# EAGLE design Quectel-2560-v2.2 (EAGLE 8.5.1)
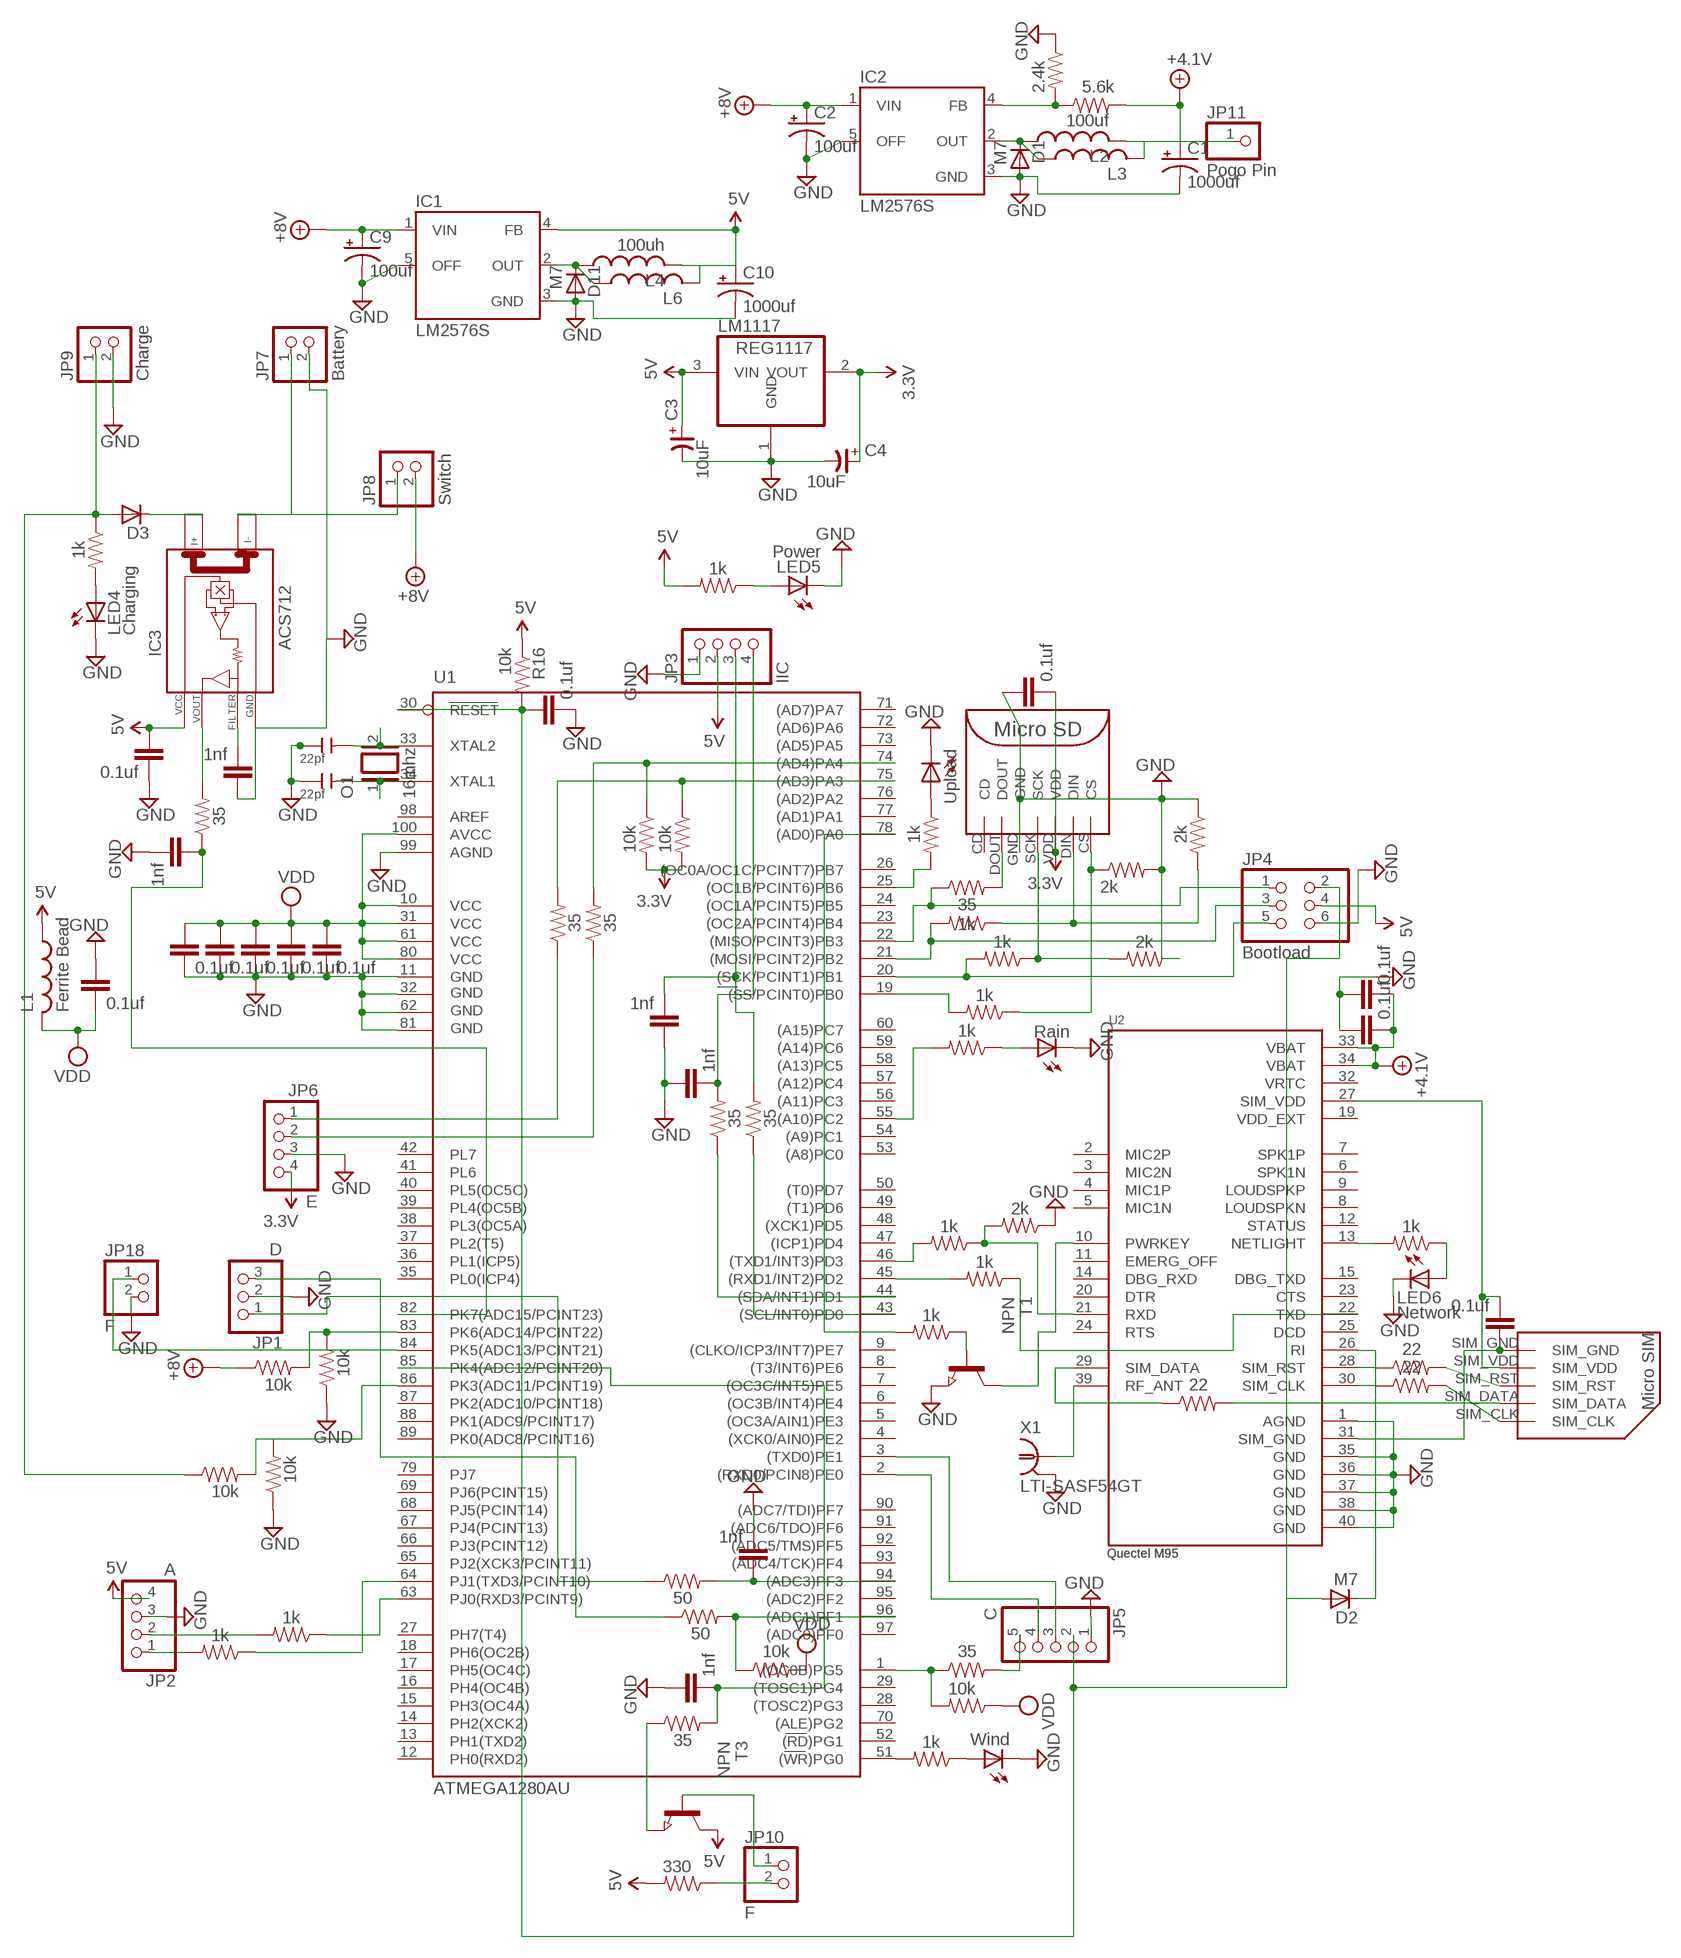
[diagram p0: schematic, sheet 1]

## Parts
C1  1000uf  CPOL-US153CLV-1012  [153CLV-1012]
C2  100uf  CPOL-USCT7343  [CT7343]
C3  10uF  CP-3528  [3528/T]
C4  10uF  CP-3528  [3528/T]
C7  22pf  CERAMIC-22PF-50V-5%-NPO(0805)  [C0805]
C8  22pf  CERAMIC-22PF-50V-5%-NPO(0805)  [C0805]
C9  100uf  CPOL-USCT7343  [CT7343]
C10  1000uf  CPOL-US153CLV-1012  [153CLV-1012]
D1  M7  BYS10  [SOD106A]
D2  M7  BYS10  [SOD106A]
D3  BYS10  [SOD106A]
D11  M7  BYS10  [SOD106A]
DC1  0.1uf  C-EUC0805  [C0805]
DC2  0.1uf  C-EUC0805  [C0805]
DC3  0.1uf  C-EUC0805  [C0805]
DC4  0.1uf  C-EUC0805  [C0805]
DC5  0.1uf  C-EUC0805  [C0805]
DC6  0.1uf  C-EUC0805  [C0805]
DC7  0.1uf  C-EUC0805  [C0805]
DC10  0.1uf  C-EUC0805  [C0805]
DC11  0.1uf  C-EUC0805  [C0805]
DC12  1nf  C-EUC0805  [C0805]
DC13  1nf  C-EUC0805  [C0805]
DC14  1nf  C-EUC0805  [C0805]
DC15  0.1uf  C-EUC0805  [C0805]
DC17  1nf  C-EUC0805  [C0805]
DC18  0.1uf  C-EUC0805  [C0805]
DC19  0.1uf  C-EUC0805  [C0805]
DC20  1nf  C-EUC0805  [C0805]
DC21  1nf  C-EUC0805  [C0805]
IC1  LM2576S  [TO263-5]
IC2  LM2576S  [TO263-5]
IC3  ACS712  [SO08]
JP1  D  PINHD-1X3  [1X03]
JP2  A  PINHD-1X4  [1X04]
JP3  IIC  PINHD-1X4  [1X04]
JP4  Bootload  PINHD-2X3  [2X03]
JP5  C  PINHD-1X5  [1X05]
JP6  E  PINHD-1X4  [1X04]
JP7  Battery  PINHD-1X2  [1X02]
JP8  Switch  PINHD-1X2  [1X02]
JP9  Charge  PINHD-1X2  [1X02]
JP10  F  PINHD-1X2  [1X02]
JP11  Pogo Pin  PINHD-1X1  [1X01]
JP18  F  PINHD-1X2  [1X02]
L1  Ferrite Bead  L-USL2012C  [L2012C]
L2  100uf  L-USPIS2816  [PIS2816]
L3  L-US6000-XXX-RC  [6000-XXXX-RC]
L4  100uh  L-USPIS2816  [PIS2816]
L6  L-US6000-XXX-RC  [6000-XXXX-RC]
LED1  Rain  LEDCHIP-LED0805  [CHIP-LED0805]
LED2  Upload  LEDCHIP-LED0805  [CHIP-LED0805]
LED3  Wind  LEDCHIP-LED0805  [CHIP-LED0805]
LED4  Charging  LEDCHIP-LED0805  [CHIP-LED0805]
LED5  Power  LEDCHIP-LED0805  [CHIP-LED0805]
LED6  Network  LEDCHIP-LED0805  [CHIP-LED0805]
LM1117  REG1117  [SOT223]
O1  16mhz  XTAL/S  [QS]
R1  35  RESISTOR0805-RES  [0805]
R2  10k  RESISTOR0805-RES  [0805]
R3  10k  RESISTOR0805-RES  [0805]
R4  1k  RESISTOR0805-RES  [0805]
R5  35  RESISTOR0805-RES  [0805]
R6  1k  RESISTOR0805-RES  [0805]
R7  1k  RESISTOR0805-RES  [0805]
R8  1k  RESISTOR0805-RES  [0805]
R9  2k  RESISTOR0805-RES  [0805]
R10  22  RESISTOR0805-RES  [0805]
R11  22  RESISTOR0805-RES  [0805]
R14  1k  RESISTOR0805-RES  [0805]
R15  1k  RESISTOR0805-RES  [0805]
R16  10k  RESISTOR0805-RES  [0805]
R17  1k  RESISTOR0805-RES  [0805]
R18  1k  RESISTOR0805-RES  [0805]
R19  35  RESISTOR0805-RES  [0805]
R20  10k  RESISTOR0805-RES  [0805]
R21  50  RESISTOR0805-RES  [0805]
R22  35  RESISTOR0805-RES  [0805]
R23  2k  RESISTOR0805-RES  [0805]
R24  2k  RESISTOR0805-RES  [0805]
R25  1k  RESISTOR0805-RES  [0805]
R26  1k  RESISTOR0805-RES  [0805]
R27  1k  RESISTOR0805-RES  [0805]
R28  1k  RESISTOR0805-RES  [0805]
R29  2k  RESISTOR0805-RES  [0805]
R30  35  RESISTOR0805-RES  [0805]
R31  50  RESISTOR0805-RES  [0805]
R32  1k  RESISTOR0805-RES  [0805]
R33  1k  RESISTOR0805-RES  [0805]
R34  10k  RESISTOR0805-RES  [0805]
R35  35  RESISTOR0805-RES  [0805]
R36  10k  RESISTOR0805-RES  [0805]
R39  35  RESISTOR0805-RES  [0805]
R40  10k  RESISTOR0805-RES  [0805]
R41  330  RESISTOR0805-RES  [0805]
R42  35  RESISTOR0805-RES  [0805]
R43  10k  RESISTOR0805-RES  [0805]
R44  10k  RESISTOR0805-RES  [0805]
R45  2.4k  RESISTOR0805-RES  [0805]
R46  5.6k  RESISTOR0805-RES  [0805]
R47  22  RESISTOR0805-RES  [0805]
T1  NPN  NPN-TRANSISTOR_SOT23  [SOT23]
T3  NPN  NPN-TRANSISTOR_SOT23  [SOT23]
U1  ATMEGA1280AU  ATMEGA2560AU  [TQFP100]
U2  Quectel M95  M95  [XCVR_M95]
U$1  MICROSD  [MICROSD]
U$2  MICROSIM  [MICROSIM]
X1  LTI-SASF54GT  [LTI-SASF54GT]

## Nets
3.3V: C4.+ DC10.2 JP6.4 LM1117.2(VOUT) R34.2 R36.2 U$1.VDD
5V: C3.+ C10.+ DC19.2 IC1.4(FB) IC3.8(VCC) JP2.4 JP3.2 JP4.4 L1.1 L4.2 L6.2 LM1117.3(VIN) R16.1 R18.2 R41.2 T3.3(C)
+4.1V: C1.+ DC6.2 DC7.2 JP11.1 L2.2 L3.2 R46.2 U2.33(VBAT) U2.34(VBAT)
+8V: C2.+ C9.+ IC1.1(VIN) IC2.1(VIN) JP8.2 R43.1
GND: C1.- C2.- C3.- C4.- C7.1 C8.1 C9.- C10.- D1.A D11.A DC1.2 DC2.2 DC3.2 DC4.2 DC5.2 DC6.1 DC7.1 DC10.1 DC11.2 DC12.1 DC13.1 DC14.1 DC17.2 DC18.1 DC19.1 DC20.1 DC21.2 IC1.3(GND) IC1.5(OFF) IC2.3(GND) IC2.5(OFF) IC3.5(GND) JP1.2 JP2.3 JP3.1 JP4.6 JP5.1 JP6.3 JP7.2 JP9.2 JP18.2 LED1.C LED2.C LED3.C LED4.C LED5.C LED6.C LM1117.1(GND) R3.1 R9.1 R23.2 R24.1 R29.1 R44.1 R45.1 T1.2(E) U1.11(GND) U1.32(GND1) U1.62(GND2) U1.81(GND3) U1.99(AGND) U2.1(AGND) U2.35(GND) U2.36(GND) U2.37(GND) U2.38(GND) U2.40(GND) U$1.GND X1.2 X1.3 X1.4 X1.5
N$1: DC15.1 U2.31(SIM_GND) U$2.SIM_GND
N$2: DC15.2 U2.27(SIM_VDD) U$2.SIM_VDD
N$3: R10.1 U2.28(SIM_RST)
N$4: R11.1 U2.30(SIM_CLK)
N$6: R10.2 U$2.SIM_RST
N$7: LED2.A R25.1
N$8: JP5.4 U1.2((RXD0/PCIN8)PE0)
N$9: JP5.3 U1.3((TXD0)PE1)
N$10: R7.1 R24.2 U$1.SCK
N$11: DC12.2 JP3.4 R5.2
N$12: R6.1 R9.2 U$1.DIN
N$13: D2.A DC11.1 JP4.2 JP5.2 R16.2 U1.30(RESET)
N$16: JP4.3 R6.2 U1.21((MOSI/PCINT2)PB2)
N$17: JP4.5 R7.2 U1.20((SCK/PCINT1)PB1)
N$18: DC21.1 R1.1 U1.82(PK7(ADC15/PCINT23))
N$19: IC3.4(I-_1) JP7.1 JP8.1
N$20: R8.2 U1.19((SS/PCINT0)PB0)
N$21: U2.39(RF_ANT) X1.1
N$22: R22.2 R36.1 U1.75((AD3)PA3)
N$23: R5.1 U1.44((SDA/INT1)PD1)
N$25: T1.3(C) U2.10(PWRKEY)
N$26: LED3.A R28.1
N$27: LED4.A R26.2
N$28: IC3.7(VOUT) R1.2
N$29: R11.2 U$2.SIM_CLK
N$30: C7.2 O1.2 U1.33(XTAL2)
N$31: C8.2 O1.1 U1.34(XTAL1)
N$32: DC13.2 JP3.3 R30.2
N$33: R28.2 U1.51((WR)PG0)
N$34: LED1.A R27.1
N$35: R8.1 R23.1 U$1.CS
N$36: R2.2 R3.2 U1.86(PK3(ADC11/PCINT19))
N$37: D3.A JP9.1 R2.1 R26.1
N$38: R4.1 T1.1(B)
N$39: R25.2 U1.25((OC1B/PCINT6)PB6)
N$40: R14.2 U1.46((TXD1/INT3)PD3)
N$41: R15.2 U1.45((RXD1/INT2)PD2)
N$42: R14.1 R29.2 U2.21(RXD)
N$43: R15.1 U2.22(TXD)
N$44: R19.2 R34.1 U1.74((AD4)PA4)
N$45: JP5.5 R39.2
N$47: R20.1 R31.2 U1.96((ADC1)PF1)
N$48: R27.2 U1.55((A10)PC2)
N$49: JP4.1 R35.1 U1.22((MISO/PCINT3)PB3)
N$50: R17.2 U2.13(NETLIGHT)
N$51: LED6.A R17.1
N$52: JP6.1 R22.1
N$53: JP1.1 R21.1
N$54: DC17.1 R21.2 U1.94((ADC3)PF3)
N$55: R30.1 U1.43((SCL/INT0)PD0)
N$56: JP6.2 R19.1
N$57: JP1.3 R31.1
N$58: JP2.2 R32.2
N$60: LED5.A R18.1
N$61: JP10.2 R41.1
N$62: R32.1 U1.63(PJ0(RXD3/PCINT9))
N$63: JP2.1 R33.2
N$64: R35.2 U$1.DOUT
N$65: D11.K IC1.2(OUT) L4.1 L6.1
N$66: R33.1 U1.64(PJ1(TXD3/PCINT10))
N$67: R47.2 U$2.SIM_DATA
N$68: R47.1 U2.29(SIM_DATA)
N$69: R4.2 U1.78((AD0)PA0)
N$70: D2.K U2.26(RI)
N$71: R39.1 R40.2 U1.1((OC0B)PG5)
N$73: JP10.1 T3.1(B)
N$74: R42.1 T3.2(E)
N$75: DC14.2 R42.2 U1.85(PK4(ADC12/PCINT20))
N$76: R43.2 R44.2 U1.83(PK6(ADC14/PCINT22))
N$77: D1.K IC2.2(OUT) L2.1 L3.1
N$78: IC2.4(FB) R45.2 R46.1
N$79: JP18.1 U1.84(PK5(ADC13/PCINT21))
N$90: D3.K IC3.1(I+_0)
N$91: DC20.2 IC3.6(FILTER)
VDD: DC1.1 DC2.1 DC3.1 DC4.1 DC5.1 DC18.2 L1.2 R20.2 R40.1 U1.10(VCC) U1.31(VCC1) U1.61(VCC2) U1.80(VCC3) U1.100(AVCC)
Unconnected: IC3.2(I+_1) IC3.3(I-_0) U1.4((XCK0/AIN0)PE2) U1.5((OC3A/AIN1)PE3) U1.6((OC3B/INT4)PE4) U1.7((OC3C/INT5)PE5) U1.8((T3/INT6)PE6) U1.9((CLKO/ICP3/INT7)PE7) U1.12(PH0(RXD2)) U1.13(PH1(TXD2)) U1.14(PH2(XCK2)) U1.15(PH3(OC4A)) U1.16(PH4(OC4B)) U1.17(PH5(OC4C)) U1.18(PH6(OC2B)) U1.23((OC2A/PCINT4)PB4) U1.24((OC1A/PCINT5)PB5) U1.26((OC0A/OC1C/PCINT7)PB7) U1.27(PH7(T4)) U1.28((TOSC2)PG3) U1.29((TOSC1)PG4) U1.35(PL0(ICP4)) U1.36(PL1(ICP5)) U1.37(PL2(T5)) U1.38(PL3(OC5A)) U1.39(PL4(OC5B)) U1.40(PL5(OC5C)) U1.41(PL6) U1.42(PL7) U1.47((ICP1)PD4) U1.48((XCK1)PD5) U1.49((T1)PD6) U1.50((T0)PD7) U1.52((RD)PG1) U1.53((A8)PC0) U1.54((A9)PC1) U1.56((A11)PC3) U1.57((A12)PC4) U1.58((A13)PC5) U1.59((A14)PC6) U1.60((A15)PC7) U1.65(PJ2(XCK3/PCINT11)) U1.66(PJ3(PCINT12)) U1.67(PJ4(PCINT13)) U1.68(PJ5(PCINT14)) U1.69(PJ6(PCINT15)) U1.70((ALE)PG2) U1.71((AD7)PA7) U1.72((AD6)PA6) U1.73((AD5)PA5) U1.76((AD2)PA2) U1.77((AD1)PA1) U1.79(PJ7) U1.87(PK2(ADC10/PCINT18)) U1.88(PK1(ADC9/PCINT17)) U1.89(PK0(ADC8/PCINT16)) U1.90((ADC7/TDI)PF7) U1.91((ADC6/TDO)PF6) U1.92((ADC5/TMS)PF5) U1.93((ADC4/TCK)PF4) U1.95((ADC2)PF2) U1.97((ADC0)PF0) U1.98(AREF) U2.2(MIC2P) U2.3(MIC2N) U2.4(MIC1P) U2.5(MIC1N) U2.6(SPK1N) U2.7(SPK1P) U2.8(LOUDSPKN) U2.9(LOUDSPKP) U2.11(EMERG_OFF) U2.12(STATUS) U2.14(DBG_RXD) U2.15(DBG_TXD) U2.20(DTR) U2.23(CTS) U2.24(RTS) U2.25(DCD) U$1.CD

## Power pins joined to a net without a drawn wire
VDD_EXT: U2.19(VDD_EXT)
VRTC: U2.32(VRTC)

## Library data of the parts
C1 C2 C9 C10 = rcl:CPOL-US: POLARIZED CAPACITOR, American symbol
C3 C4 = cap-master:CP-: POLARIZED CAP
C7 C8 = Seeed-OPL-Capacitor:CERAMIC-22PF-50V-5%-NPO(0805): 302010151; MPN: CC0805JRNPO9BN220
D1-D3 D11 = telefunken:BYS10: DIODE; MPN: BYS10/45; OC_FARNELL: 9549188; OC_NEWARK: 96K7236
DC1-DC7 DC10-DC15 DC17-DC21 = resistor:C-EU: CAPACITOR, European symbol
IC1 IC2 = lm2576:LM2576: National Semiconductor <http://www.national.com> 3.0A "Simple Switcher"(c) 52kHz, Vout 1.23-37V (HV: 57V), Vin 40V (HV: 60V), 50µA standby current
IC3 = ACS712:ACS712
JP1 = pinhead:PINHD-1X3: PIN HEADER
JP2 JP3 JP6 = pinhead:PINHD-1X4: PIN HEADER
JP4 = pinhead:PINHD-2X3: PIN HEADER
JP5 = pinhead:PINHD-1X5: PIN HEADER
JP7-JP10 JP18 = pinhead:PINHD-1X2: PIN HEADER
JP11 = pinhead:PINHD-1X1: PIN HEADER
L1-L4 L6 = rcl:L-US: INDUCTOR, American symbol
LED1-LED6 = led:LED: LED OSRAM: - CHIPLED LG R971, LG N971, LY N971, LG Q971, LY Q971, LO R971, LY R971 LH N974, LH R974 LS Q976, LO Q976, LY Q976 LO Q996 - Hyper CHIPLED LW Q18S LB Q993, LB Q99A, LB R99A - SideLED LS A670, LO A670, LY A670, LG A670, LP A670 LB A673, LV A673, LT A673, LW A673 LH A674 LY A675 LS A676, LA A676, LO A676, LY A676, LW A676 LS A679, LY A679, LG A679 - Hyper Micro SIDELED® LS Y876, LA Y876, LO Y876, LY Y876 LT Y87S - SmartLED LW L88C, LW L88S LB L89C, LB L89S, LG L890 LS L89K, LO L89K, LY L89K LS L896, LA L896, LO L896, LY L896 - TOPLED LS T670, LO T670, LY T670, LG T670, LP T670 LSG T670, LSP T670, LSY T670, LOP T670, LYG T670 LG T671, LOG T671, LSG T671 LB T673, LV T673, LT T673, LW T673 LH T674 LS T676, LA T676, LO T676, LY T676, LB T676, LH T676, LSB T676, LW T676 LB T67C, LV T67C, LT T67C, LS T67K, LO T67K, LY T67K, LW E67C LS E67B, LA E67B, LO E67B, LY E67B, LB E67C, LV E67C, LT E67C LW T67C LS T679, LY T679, LG T679 LS T770, LO T770, LY T770, LG T770, LP T770 LB T773, LV T773, LT T773, LW T773 LH T774 LS E675, LA E675, LY E675, LS T675 LS T776, LA T776, LO T776, LY T776, LB T776 LHGB T686 LT T68C, LB T68C - Hyper Mini TOPLED® LB M676 - Mini TOPLED Santana® LG M470 LS M47K, LO M47K, LY M47K Source: http://www.osram.convergy.de LUXEON: - LUMILED® LXK2-PW12-R00, LXK2-PW12-S00, LXK2-PW14-U00, LXK2-PW14-V00 LXK2-PM12-R00, LXK2-PM12-S00, LXK2-PM14-U00 LXK2-PE12-Q00, LXK2-PE12-R00, LXK2-PE12-S00, LXK2-PE14-T00, LXK2-PE14-U00 LXK2-PB12-K00, LXK2-PB12-L00, LXK2-PB12-M00, LXK2-PB14-N00, LXK2-PB14-P00, LXK2-PB14-Q00 LXK2-PR12-L00, LXK2-PR12-M00, LXK2-PR14-Q00, LXK2-PR14-R00 LXK2-PD12-Q00, LXK2-PD12-R00, LXK2-PD12-S00 LXK2-PH12-R00, LXK2-PH12-S00 LXK2-PL12-P00, LXK2-PL12-Q00, LXK2-PL12-R00 Source: www.luxeon.com KINGBRIGHT: KA-3528ASYC Source: www.kingbright.com
LM1117 = burr-brown:REG1117: 800mA and 1A Low Dropout (LDO) Positive Regulator 1.8V, 2.5V, 2.85V, 3.3V, 5V, and Adj; MPN: REG1117; OC_FARNELL: 1097566; OC_NEWARK: 14P6981
O1 = special:XTAL/S: CRYSTAL
R1-R11 R14-R36 R39-R47 = SparkFun-Resistors:RESISTOR: Resistor Basic schematic elements and footprints for 0603, 1206, and PTH resistors.
T1 T3 = semicon-smd-ipc:NPN-TRANSISTOR_: NPN TRANSISTOR
U1 = SparkFun-DigitalIC:ATMEGA2560: Atmel 100-pin 8-bit uC 64/128/256 Kbytes FLASH 4 Kbytes EEPROM 8 Kbytes SRAM 86 General Purpose I/O pins 12-channels16-bit PWM 4 x Serial USARTs 16-channels 10-bit A/D; PROD_ID: IC-10040
U2 = M95:M95: Quad-Band GSM/GPRS Module LCC
U$1 = MicroSD:MICROSD
U$2 = MicroSD:MICROSIM
X1 = con-coax:LTI-SASF54GT: SMA vertical PCB thrue hole jack Source: Lighthorse Technologies, inc. SASF54GT.pdf; OC_FARNELL: unknown; OC_NEWARK: unknown

## Net classes
0 default: clearance 0.205 mm

## Board
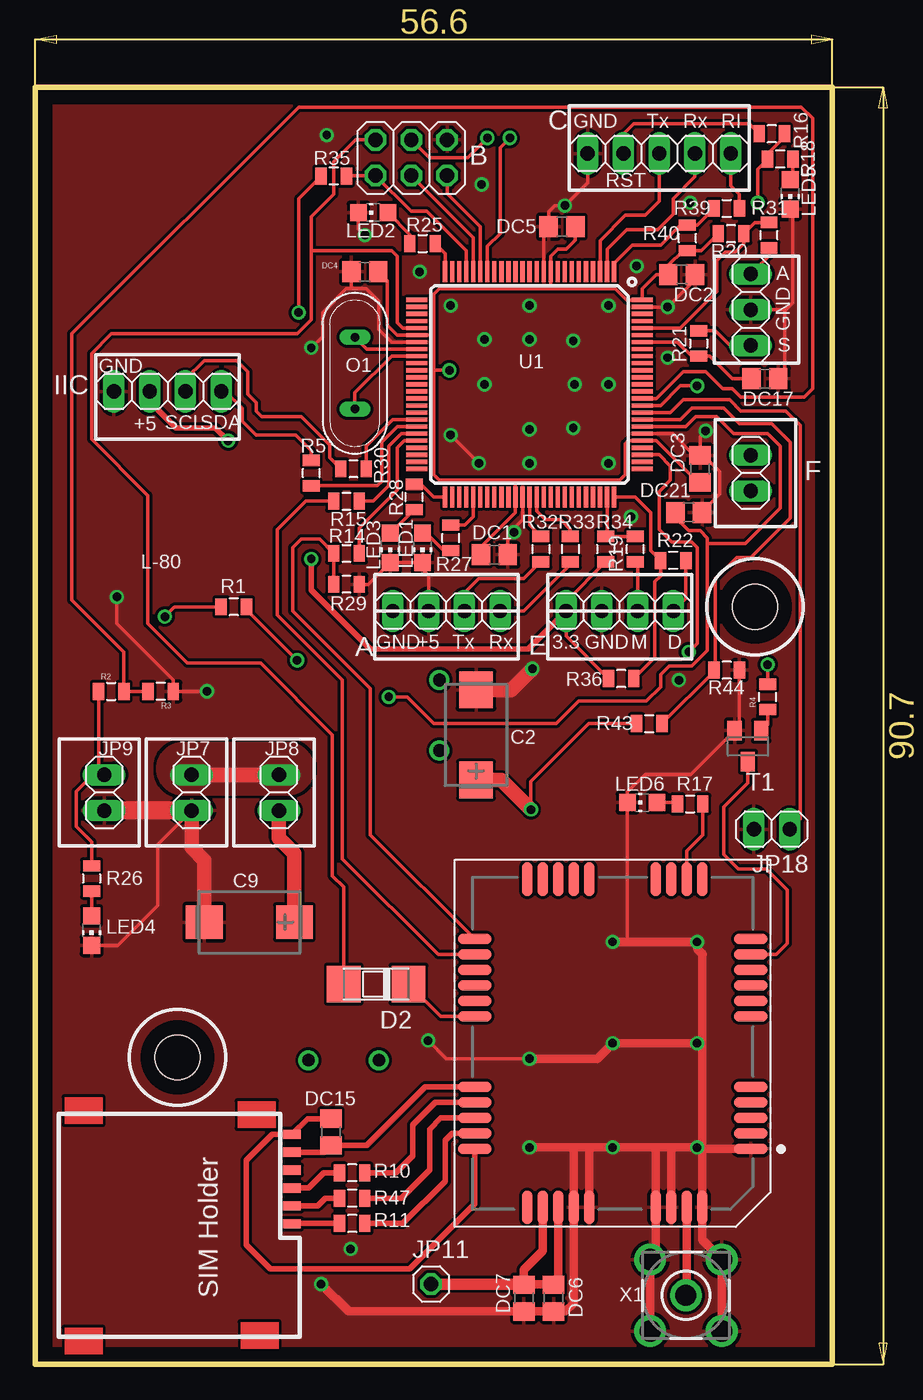
[diagram p1: board, top side]
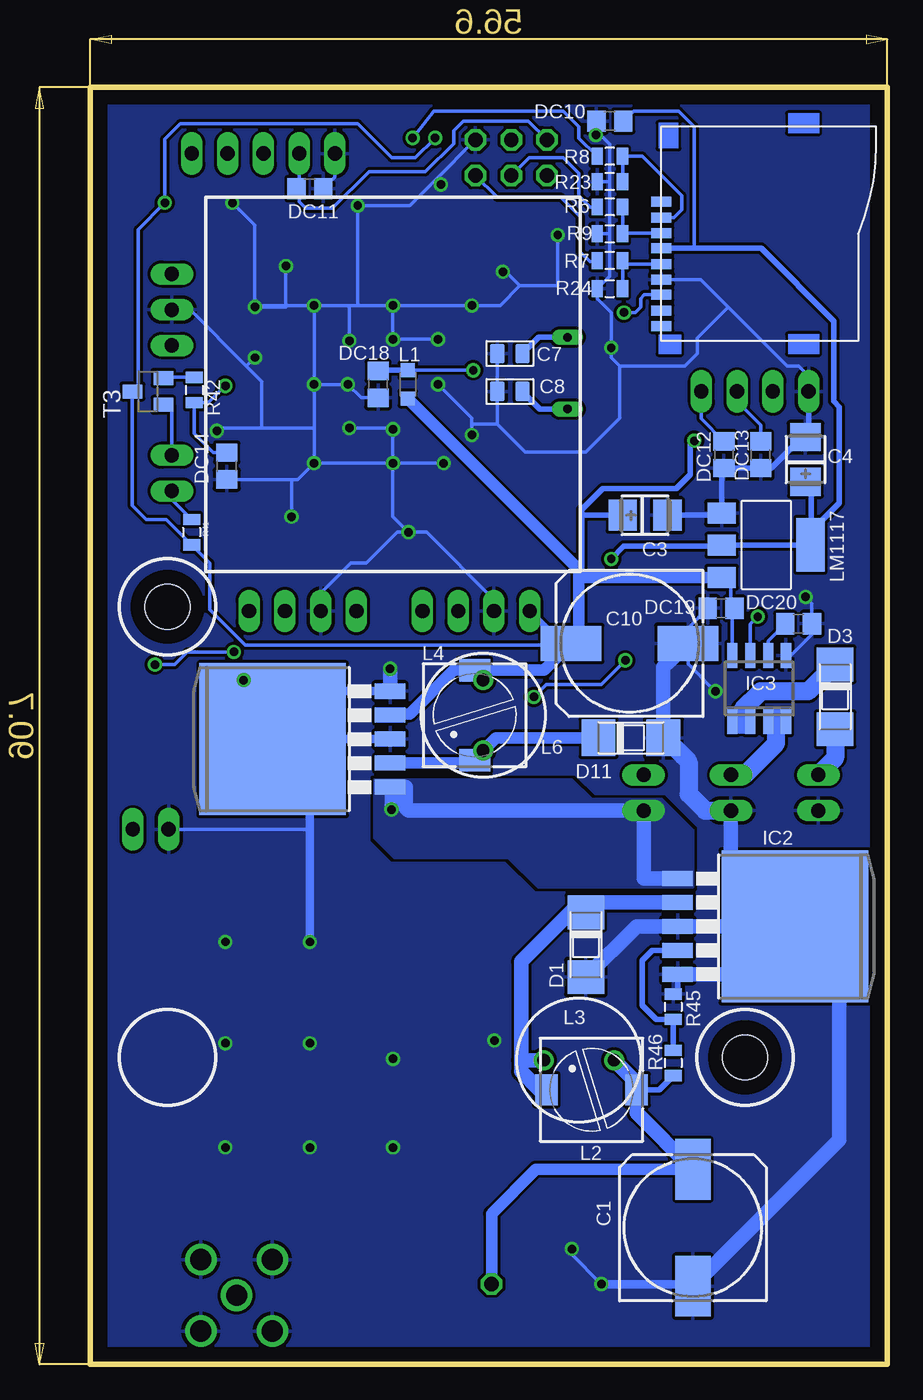
[diagram p2: board, bottom side, seen from below]

Size 56.6 x 90.7 mm. Coordinates in mm from the lower left corner, seen from the top.
Outline: 56.6,0 56.6,90.7 0,90.7 0,0 20.8,0 41.6,0 56.6,0
Copper layers (1*16): Top 0.035mm / dielectric 1mm / Bottom 0.035mm
Design rules "Quectel-2560-v2.1": minimum track width 10mil, minimum drill 24mil, track to track 0.205mm, track to pad 0.205mm, pad to pad 0.205mm, via to via 0.205mm, smd to smd 8mil, copper to edge 40mil, drill to drill 8mil, minimum pad ring 10mil, minimum via ring 8mil, stop-mask expansion 4mil, vias tented up to drill 0mil, thermal gap 10mil
Holes 3.2 mm at 10.1,21.8 51.1,53.8

### Footprints (pad centres in the part's own frame; a part is rotated, then mirrored left to right if it is on the bottom)
153CLV-1012 = smd 4.3 x 2.5: + 4.15,0; - -4.15,0
CT7343 = smd 2.6 x 2.4: + -3.2,0; - 3.2,0
3528/T = smd 2 x 2.2: + 1.587,0; - -1.587,0
C0805 = smd 1.397 x 1.016: 1 0,0.889; 2 0,-0.889
SOD106A = smd 2.4 x 2.6: A 2.3,0; K -2.3,0
C0805' = smd 1.3 x 1.5: 1 -0.95,0; 2 0.95,0
TO263-5 = smd 1.067 x 2.159: 1 -3.404,-5.791; 2 -1.702,-5.791; 3 0,-5.791; 4 1.702,-5.791; 5 3.404,-5.791 | smd 10.8 x 10.41: 6 0,2.54
SO08 = smd 0.72 x 1.78: 1 -1.905,-2.35; 2 -0.635,-2.35; 3 0.635,-2.35; 4 1.905,-2.35; 5 1.905,2.35; 6 0.635,2.35; 7 -0.635,2.35; 8 -1.905,2.35
1X03 = drill 1.016 long: 1 -2.54,0; 2 0,0; 3 2.54,0
1X04 = drill 1.016 long: 1 -3.81,0; 2 -1.27,0; 3 1.27,0; 4 3.81,0
2X03 = drill 1.016 octagon: 1 -2.54,-1.27; 2 -2.54,1.27; 3 0,-1.27; 4 0,1.27; 5 2.54,-1.27; 6 2.54,1.27
1X05 = drill 1.016 long: 1 -5.08,0; 2 -2.54,0; 3 0,0; 4 2.54,0; 5 5.08,0
1X02 = drill 1.016 long: 1 -1.27,0; 2 1.27,0
1X01 = drill 1.016 octagon: 1 0,0
L2012C = smd 1 x 1: 1 -1,0; 2 1,0
PIS2816 = smd 2.2 x 1.6: 1 0,3.2; 2 0,-3.2
6000-XXXX-RC = drill 0.9 pad 1.422: 1 -2.5,0; 2 2.5,0
CHIP-LED0805 = smd 1.2 x 1.2: A 0,-1.05; C 0,1.05
SOT223 = smd 1.499 x 2.007: 1 -2.261,-3.15; 2 0.025,-3.15; 3 2.311,-3.15 | smd 3.81 x 2.007: 4 0,3.15
QS = drill 0.61 long: 1 -2.54,0; 2 2.54,0
0805 = smd 0.8 x 1.2: 1 -0.9,0; 2 0.9,0
SOT23 = smd 1 x 1.4: 1 -0.95,-1.1; 2 0.95,-1.1; 3 0,1.1
TQFP100 = smd 1.5 x 0.3: 1 -8,6; 2 -8,5.5; 3 -8,5; 4 -8,4.5; 5 -8,4; 6 -8,3.5; 7 -8,3; 8 -8,2.5; 9 -8,2; 10 -8,1.5; 11 -8,1; 12 -8,0.5; 13 -8,0; 14 -8,-0.5; 15 -8,-1; 16 -8,-1.5; 17 -8,-2; 18 -8,-2.5; 19 -8,-3; 20 -8,-3.5; 21 -8,-4; 22 -8,-4.5; 23 -8,-5; 24 -8,-5.5; 25 -8,-6; 51 8,-6; 52 8,-5.5; 53 8,-5; 54 8,-4.5; 55 8,-4; 56 8,-3.5; 57 8,-3; 58 8,-2.5; 59 8,-2; 60 8,-1.5; 61 8,-1; 62 8,-0.5; 63 8,0; 64 8,0.5; 65 8,1; 66 8,1.5; 67 8,2; 68 8,2.5; 69 8,3; 70 8,3.5; 71 8,4; 72 8,4.5; 73 8,5; 74 8,5.5; 75 8,6 | smd 0.3 x 1.5: 26 -6,-8; 27 -5.5,-8; 28 -5,-8; 29 -4.5,-8; 30 -4,-8; 31 -3.5,-8; 32 -3,-8; 33 -2.5,-8; 34 -2,-8; 35 -1.5,-8; 36 -1,-8; 37 -0.5,-8; 38 0,-8; 39 0.5,-8; 40 1,-8; 41 1.5,-8; 42 2,-8; 43 2.5,-8; 44 3,-8; 45 3.5,-8; 46 4,-8; 47 4.5,-8; 48 5,-8; 49 5.5,-8; 50 6,-8; 76 6,8; 77 5.5,8; 78 5,8; 79 4.5,8; 80 4,8; 81 3.5,8; 82 3,8; 83 2.5,8; 84 2,8; 85 1.5,8; 86 1,8; 87 0.5,8; 88 0,8; 89 -0.5,8; 90 -1,8; 91 -1.5,8; 92 -2,8; 93 -2.5,8; 94 -3,8; 95 -3.5,8; 96 -4,8; 97 -4.5,8; 98 -5,8; 99 -5.5,8; 100 -6,8
XCVR_M95 = smd 2.4 x 0.75: 1 -9.8,7.5; 2 -9.8,6.4; 3 -9.8,5.3; 4 -9.8,4.2; 5 -9.8,3.1; 6 -9.8,-1.9; 7 -9.8,-3; 8 -9.8,-4.1; 9 -9.8,-5.2; 10 -9.8,-6.3; 11 -9.8,-7.4; 21 9.8,-7.4; 22 9.8,-6.3; 23 9.8,-5.2; 24 9.8,-4.1; 25 9.8,-3; 26 9.8,-1.9; 27 9.8,3.1; 28 9.8,4.2; 29 9.8,5.3; 30 9.8,6.4; 31 9.8,7.5 | smd 0.75 x 2.4: 12 -6.35,-11.65; 13 -5.25,-11.65; 14 -4.15,-11.65; 15 -3.05,-11.65; 16 1.65,-11.65; 17 2.75,-11.65; 18 3.85,-11.65; 19 4.95,-11.65; 20 6.05,-11.65; 32 6.05,11.65; 33 4.95,11.65; 34 3.85,11.65; 35 2.75,11.65; 36 1.65,11.65; 37 -3.05,11.65; 38 -4.15,11.65; 39 -5.25,11.65; 40 -6.35,11.65
MICROSD = smd 1.422 x 0.711: CD -6.35,-6.553; CS -6.35,1.143; DIN -6.35,0.051; DOUT -6.35,-4.343; GND -6.35,-3.251; P$3 -6.35,2.261; P$8 -6.35,-4.343; P$9 -6.35,-4.343; P$10 -6.35,-5.461; SCK -6.35,-2.159; VDD -6.35,-1.041
MICROSIM = smd 0.66 x 1.27: NC -3.29,9.23; SIM_CLK 0.515,9.23; SIM_DATA -0.76,9.23; SIM_GND -5.83,9.23; SIM_RST -2.025,9.23; SIM_VDD -4.565,9.23
LTI-SASF54GT = drill 1.5 pad 2.2: 1 0,0; 2 -2.54,2.54; 3 2.54,2.54; 4 2.54,-2.54; 5 -2.54,-2.54

### Placement (x,y rotation side)
C1  13.8,9.7 90 bottom
C2  31.3,44.7 90 top
C3  17.2,60.3 180 bottom
C4  5.81,64.26 270 bottom
C7  26.8,71.79 90 bottom
C8  26.8,69.1 90 bottom
C9  15.2,31.4 180 top
C10  18.3,51.2 180 bottom
D1  21.4,29.8 270 bottom
D2  24.2,27 180 top
D3  3.71,47.41 270 bottom
D11  18.2,44.5 0 bottom
DC1  0.1uf  [C0805']  32.6,57.5 0 top
DC2  0.1uf  [C0805']  45.9,77.4 0 top
DC3  0.1uf  [C0805']  47.2,63.6 90 top
DC4  0.1uf  [C0805']  23.4,77.6 180 top
DC5  0.1uf  [C0805']  37.4,80.8 180 top
DC6  0.1uf  [C0805']  36.8,4.7 90 top
DC7  0.1uf  [C0805']  34.7,4.7 90 top
DC10  0.1uf  [C0805']  19.7,88.3 0 bottom
DC11  0.1uf  [C0805']  41,83.5 0 bottom
DC12  1nf  [C0805']  11.6,64.6 90 bottom
DC13  1nf  [C0805']  9,64.6 90 bottom
DC14  1nf  [C0805']  46.9,63.8 90 bottom
DC15  0.1uf  [C0805']  21,16.5 270 top
DC17  1nf  [C0805']  51.8,70 0 top
DC18  0.1uf  [C0805']  36.15,69.6 90 bottom
DC19  0.1uf  [C0805']  11.8,53.7 0 bottom
DC20  1nf  [C0805']  6.3,52.6 180 bottom
DC21  1nf  [C0805']  46.4,60.5 0 top
IC1  41.1,44.4 90 bottom
IC2  9.1,31.1 270 bottom
IC3  9.1,48 0 bottom
JP1  50.8,74.9 90 top
JP2  29.2,53.5 180 top
JP3  9.4,69.1 0 top
JP4  26.7,85.7 0 top
JP5  44.3,86 0 top
JP6  41.5,53.5 180 top
JP7  11.1,40.6 270 top
JP8  17.3,40.6 270 top
JP9  4.9,40.6 270 top
JP10  50.8,63.3 270 top
JP11  28.1,5.7 0 top
JP18  52.3,38 180 top
L1  34.05,69.6 90 bottom
L2  21,19.5 90 bottom
L3  21.9,21.6 0 bottom
L4  29.3,46.1 180 bottom
L6  28.7,46.1 90 bottom
LED1  27.5,58 180 top
LED2  24,81.8 90 top
LED3  25.2,58 180 top
LED4  4,30.8 180 top
LED5  53.6,83.1 180 top
LED6  43.1,39.9 90 top
LM1117  8.6,58.2 270 bottom
O1  22.7,70.4 90 top
R1  14.1,53.8 180 top
R2  5.4,47.8 0 top
R3  8.9,47.8 180 top
R4  52,47.4 90 top
R5  19.6,63.3 90 top
R6  19.7,82.2 180 bottom
R7  19.7,78.4 180 bottom
R8  19.7,85.8 180 bottom
R9  19.7,80.3 0 bottom
R10  22.5,13.6 180 top
R11  22.5,10 180 top
R14  22.1,57.6 0 top
R15  22.1,61.3 0 top
R16  52.3,87.4 180 top
R17  46.5,39.8 0 top
R18  52.9,85.6 180 top
R19  42.6,57.9 90 top
R20  49.4,80.3 180 top
R21  47.1,72.5 270 top
R22  45.3,57.1 180 top
R23  19.7,84 180 bottom
R24  19.7,76.4 0 bottom
R25  27.5,79.6 0 top
R26  4,34.5 270 top
R27  29.5,58.7 90 top
R28  26.9,61.6 90 top
R29  22.1,55.4 180 top
R30  22.6,63.6 180 top
R31  52.1,80.2 90 top
R32  35.9,57.9 270 top
R33  38,57.9 270 top
R34  40.5,57.9 270 top
R35  21.2,84.4 180 top
R36  41.6,48.7 180 top
R39  49.1,82.1 0 top
R40  46.3,80 90 top
R41  49.4,59.1 270 bottom
R42  49.2,69.2 270 bottom
R43  43.6,45.5 0 top
R44  49.1,49.3 180 top
R45  15.2,25.4 270 bottom
R46  15.2,21.4 270 bottom
R47  22.5,11.8 180 top
T1  50.6,43.9 180 top
T3  52.5,69.1 90 bottom
U1  35.1,69.6 270 top
U2  41,22.8 180 top
U$1  9.7,80.3 0 bottom
U$2  9,10.5 270 top
X1  46.2,4.9 0 top

### Tracks (layer width: path | path; a pad name or v marks a point on that pad's centre or on a via)
3.3V  (via drill 0.6)
  Top 0.254: R36.2 37.69,51.71 JP6.4 37.69,54.19 R34.2
  Top 0.406: v19.6,57.2 19.6,55 23.8,50.8 34.99,50.8 JP6.4
  Bottom 0.254: 13.7,79.26 13.7,87.9 14.8,89 18,89 18.7,88.3 DC10.2
  Bottom 0.406: 13.7,79.26 U$1.VDD 8.96,79.26 3.8,74.1 3.8,68.4 3.4,68 3.4,61.18 5.39,59.19 | 5.39,59.19 5.85,58.75 6.33,58.17 LM1117.2 11.82,58.1 18.7,58.1 v19.6,57.2 | C4.+ 5.39,62.25 5.39,59.19
5V  (via drill 0.6)
  Top 0.254: JP4.4 27.97,85.7 30.7,85.7 v32.1,87.1 | 53.5,87.7 R16.1 53.2,87.2 52,86 R18.2 51.3,84.9 v51.3,82.5
  Top 0.406: JP3.2 8.13,68.37 10,66.5 12.8,66.5 v13.7,65.6
  Bottom 0.254: v32.1,87.1 33.5,85.7 35.2,85.7 37.6,88.1 50.2,88.1 51.3,87 v51.3,82.5 53.2,80.6 53.2,69.1 | 53.2,69.1 T3.3 53.6,61 52.6,60 51.2,60 R41.2 48.1,56.9 48.1,53.6 45.6,51.1 22,51.1 21.9,51.2 | 53.2,69.1 53.6,68.7 | IC3.8 11.01,53.55 DC19.2 11.1,53.95 11.1,55.3 11.69,55.89 LM1117.3
  Bottom 0.406: C10.+ 21.9,51.2 21.6,51.2 | JP2.4 23.09,51.2 C10.+ | 21.7,60.2 21.7,60.7 20.2,62.2 15,62.2 14,63.2 14,65.3 v13.7,65.6 | 22.9,51.65 C10.+ | 21.7,60.2 21.6,60.3 C3.+ | 21.7,60.2 21.7,56.1 21.9,55.9
  Bottom 0.61: 22.65,51 C10.+ | 35.21,46.2 IC1.4
  Bottom 0.813: L1.1 21.9,56.45 21.9,55.9 21.9,55.7 | 21.9,55.7 21.9,51.2 | LM1117.3 21.71,55.89 21.9,55.7 | 35.21,46.2 33.9,46.2 30.8,49.3 L4.2 | L4.2 28.7,48.7 L6.2 | L4.2 24.35,49.3 C10.+
+4.1V
  Top 0.61: DC6.2 37.15,5.9 U2.34 37.15,5.6 | U2.33 36.05,8.05 34.7,6.7 DC7.2 34.75,5.7 36.75,5.7
  Top 0.813: DC7.2 34.65,5.7 JP11.1 | 36.75,5.7 DC6.2
  Bottom 0.406: R46.2 16.2,19.5 L2.2
  Bottom 0.813: C1.+ 24.95,13.85 28.1,10.7 JP11.1
  Bottom 1.016: 13.8,14.2 C1.+ 17.8,17.85 L2.2 17.8,20 L3.2
+8V  (via drill 0.6)
  Top 0.254: v35.2,39.4 35.2,41.4 39.3,45.5 R43.1
  Top 1.016: JP8.2 17.3,37.4 18.4,36.3 C9.+ | C2.+ 33.1,41.5 v35.2,39.4
  Bottom 1.016: IC2.1 17.3,34.5 JP8.2 34,39.33 34.2,39.53 34.2,41 IC1.1 35.2,40.89 v35.2,39.4
  pour Bottom (no thermals): 13.8,33.9 13.8,37.9 16,40.1 21,40.1 22.4,41.5 36.4,41.5 36.4,37.4 35,36 26.9,36 24.8,33.9
GND  (via drill 0.6)
  Top 0.254: U1.99 v44.9,75.1 46.85,77.05 DC2.2 | U1.62 34.6,60 34,59.4 v34,59.1 33.55,58.65 DC1.2 33.5,57.55 | U1.32 25.3,72.6 24.4,73.5 24.4,75.5 23.5,76.4 22.45,76.4 | 22.45,76.4 22.1,76.4 20.4,74.7 20.4,73 v19.6,72.2 | DC4.2 22.45,76.4 | LED2.C 22.95,80.65 v23.4,80.2 | U1.81 45.25,66.1 46.8,64.55 DC3.2 | JP5.1 39.22,83.92 v37.6,82.3 36.9,82.3 36.45,81.85 DC5.2 36.1,80.45 U1.11 | JP2.3 27.93,56.02 27.5,56.45 LED1.C LED3.C 23.65,55.4 R29.1 | 53.2,74.8 53.2,70.65 52.75,70.2 DC17.2 52.55,69.9 | 53.2,74.8 53.2,74.9 JP1.2 | LED4.C 5.85,29.75 8.7,32.6 8.7,36.93 JP7.2 | 42,30 42.05,30.05 LED6.C 42.05,40.65 43.3,41.9 46.55,41.9 T1.2 50,45.35 R44.1 | 53.2,74.8 53.8,75.4 53.8,81.85 LED5.C | v47.6,66.3 47.2,65.9 DC3.2 | v29.5,66 v31.5,64 | v27.9,23 29.2,21.7 v35.1,21.7 | DC3.2 47.45,64.55 48.6,63.4 48.6,61.8 47.35,60.55 DC21.2 | v5.8,54.5 5.8,52.6 9.8,48.6 R3.1 v12.2,47.8
  Top 0.61: 47.35,15.4 U2.40 47.35,8.83 X1.3 X1.4 | U2.38 45.15,15.4 | 45.15,15.4 v47,15.4 | v47,15.4 47.35,15.4 | 44.05,15.4 U2.37 44.05,7.83 X1.2 X1.5 | 44.05,15.4 45.15,15.4 | U2.36 39.35,15.4 | 39.35,15.4 v41,15.4 44.05,15.4 | 38.3,15.4 38.25,15.3 U2.35 38.25,4.35 37.65,3.75 DC6.1 DC7.1 22.25,3.75 v20.3,5.7 | 38.3,15.4 39.35,15.4 | 47.35,22.7 47.35,29.1 47.4,29.1 47,29.5 v47,30 42,30 v41,30 | 47.35,22.7 47.35,15.4 | v35.1,15.4 38.3,15.4 | U2.1 47.1,15.3 v47,15.4 | 47.35,22.7 47.25,22.8 v47,22.8 v41,22.8 39.9,21.7 v35.1,21.7
  Top 1.016: JP7.2 11.1,36.7 12,35.8 C9.- | C2.- 33.8,47.9 v35.3,49.4
  Top 1.27: JP7.2 JP9.2
  Bottom 0.254: C8.1 C7.1 | C8.1 27.79,68.9 | v44.9,75.1 42.7,75.1 | 5.59,68.86 JP3.1 5.59,70.19 6.3,70.9 7.1,70.9 11.3,75.1 | 19.7,84 19.7,86.65 20.65,87.6 DC10.1 | 19.7,84 19.7,80.3 | 19.7,80.3 19.7,77.3 R24.1 20.6,75.7 19.6,74.7 v19.6,72.2 19.6,71.5 19,70.9 | 26.1,76.6 27.5,75.2 v29.5,75.2 v35.1,75.2 | v34,59.1 32.7,59.1 27.93,54.33 JP2.3 | v34,59.1 34.8,59.1 37,56.9 38.1,56.9 40.23,54.77 JP6.3 | v23.4,80.2 23.4,76.6 26.1,76.6 | v46.5,82.5 44.9,80.9 v44.9,75.1 | DC11.2 39.22,84.33 JP5.1 | 40.7,66.5 44.4,66.5 | JP1.2 49.5,74.9 45.5,70.9 | 45.5,70.9 44.4,69.8 44.4,66.5 | v34,59.1 35.1,60.2 v35.1,64 | 32.05,84.16 33.91,82.3 v37.6,82.3 37.6,75.2 v35.1,75.2 | 32.05,84.16 JP4.6 | v22.4,8.2 22.4,7.8 v20.3,5.7 | U$1.GND 13.25,77.05 11.3,75.1 | 11.3,75.1 13.5,72.9 13.5,71.8 14.4,70.9 19,70.9 | v47.6,66.3 47.4,66.5 44.4,66.5 | 36.5,69 DC18.1 37.35,68.65 v38.3,69.6 v40.7,69.6 | v27.3,77.6 27.1,77.6 26.1,76.6 | 27.69,66.79 25.7,64.8 21.4,64.8 19,67.2 19,70.9 | 27.69,66.79 C8.1 | v35.1,75.2 38.2,75.2 | 38.2,75.2 v40.7,75.2 | v40.7,75.2 v40.7,69.6 | v40.7,69.6 40.7,66.5 | 40.7,66.5 v40.7,64 | v35.1,64 v40.7,64 | v35.1,64 v35.1,66.4 35.1,66.5 v38.2,66.5 | v35.1,75.2 v35.1,72.8 v31.9,72.8 | v38.2,72.7 38.2,75.2 | v29.5,66 29.5,66.8 | 29.5,66.8 29.5,67.2 v31.9,69.6 | 27.69,66.79 29.49,66.79 29.5,66.8 | v35.1,64 v31.5,64 | R9.1 19.7,80.3 | R23.2 19.7,84 | DC14.1 42.3,62.85 | 42.3,62.85 41.85,62.85 v40.7,64 | IC3.5 6.85,50.35 5.35,51.85 DC20.1 5.35,54.05 v5.8,54.5 | DC19.1 14.15,52.3 C10.- 14.15,49.75 v12.2,47.8 | 42.3,62.85 v42.3,60.2 | 16.22,46.8 15.92,46.5 | v40.7,75.2 42.7,75.2 | 42.7,75.2 v42.7,78 | 42.7,75.2 44.8,75.2 v44.9,75.1 | v31.7,83.8 32.05,84.16
  Bottom 0.254: 45.5,70.9 v44.9,71.5 | JP18.2 41,38 41,37.8
  Bottom 0.406: R45.1 14.89,26.39 IC2.5 | LM1117.1 11.6,60.61 | DC12.1 DC13.1 | 6.25,65.05 C4.- | DC12.1 11.75,63.5 LM1117.1 | LM1117.1 11.91,60.3 C3.- | C4.- 5.59,66.07 JP3.1 | DC12.1 8.25,63.65 6.05,65.85 C4.-
  Bottom 0.61: C1.- 13.95,5.7 v20.3,5.7 | IC1.5 40.9,47.8 | 40.9,47.8 40.9,44.4 | 40.9,44.4 IC1.3 | 40.9,44.4 41,44.3 41,37.8 v41,30 | v45.7,48.6 40.9,48.6 40.9,47.8
  Bottom 1.016: 11.1,31.1 5.1,31.1 5.1,27.7 | 11.1,31.1 IC2.3 17.8,31.1 D1.A | IC2.5 5.1,27.7 | JP7.2 11.1,31.1 | C10.- 15.93,49.52 15.93,47.12 15.92,46.5 D11.A 14.6,43.2 14.5,43.2 | C1.- 3.4,15.95 3.4,26 5.1,27.7 | v35.3,49.4 35.3,47.81 IC1.5
  Bottom 1.27: 15.8,44.5 14.5,43.2 14.1,42.8 14.1,40.5 12.93,39.33 JP7.2
  other vias: 20.7,87.3
  pour Top (rank 2): 0,90.7 0,0 56.6,0 56.6,90.7
  pour Bottom (rank 2): -1.7,89.8 0,0 56.6,0 56.6,90.7
N$1
  Top 0.406: DC15.1 19.35,17.45 U$2.SIM_GND 16.83,16.33 15,14.5 15,8.5 16.7,6.8 26.6,6.8 31.2,11.4 U2.31
N$2
  Top 0.406: U$2.SIM_VDD 20.52,15.06 DC15.2 23.55,15.55 27.7,19.7 U2.27
N$3
  Top 0.406: R10.1 25.6,13.6 26.8,14.8 26.8,17 28.4,18.6 U2.28
N$4
  Top 0.406: R11.1 26.1,10 29.1,13 29.1,15.9 29.6,16.4 U2.30
N$6
  Top 0.406: U$2.SIM_RST 19.43,12.53 20.5,13.6 R10.2
N$7
  Top 0.254: LED2.A 26.6,80.25 R25.1
N$8
  Top 0.254: JP5.4 46.84,84.34 45.3,82.8 45.3,81.7 44.2,80.6 42,80.6 40.6,79.2 U1.2
N$9
  Top 0.254: JP5.3 44.3,82.6 43.3,81.6 41.9,81.6 40.1,79.8 U1.3
N$10
  Bottom 0.254: U$1.SCK 18.46,78.14 R7.1 R24.2
N$11
  Top 0.254: JP3.4 13.5,69.1 14.7,67.9 14.7,67 15.7,66 18.5,66 19.6,64.9 R5.2
  Bottom 0.254: DC12.2 13.21,67.16 JP3.4
N$12
  Bottom 0.254: R6.1 R9.2 18.8,80.35 U$1.DIN
N$13
  Top 0.254: U1.30 26.1,73.6 25.7,74 25.7,78.7 25.3,79.1 19.6,79.1 | 19.6,79.1 19.6,81.5 21.2,83.1 21.2,85.4 22.77,86.97 JP4.2 | JP5.2 41.76,87.36 42.5,88.1 50.7,88.1 R16.2 | D2.A 21.9,33.9 21.1,34.7 21.1,44.7 16,49.8 10.8,49.8 8,52.6 8,61.7 4,65.7 4,71.8 5.4,73.2 18.6,73.2 19.6,74.2 19.6,79.1
  Bottom 0.254: JP4.2 25.49,88.3 30.1,88.3 30.8,87.6 30.8,86.7 32.8,84.7 36.8,84.7 39.4,82.1 41.3,82.1 41.76,82.56 41.76,83.69 | JP5.2 41.76,83.69 | 41.76,83.69 DC11.1
N$16
  Top 0.254: JP4.3 31.1,80.03 U1.21
  Bottom 0.254: JP4.3 25.43,85.7 23,85.7 21.9,84.6 21.9,83 21.1,82.2 R6.2
N$17
  Top 0.254: JP4.5 29.24,83.16 31.6,80.8 U1.20
  Bottom 0.254: JP4.5 27.71,82.9 23.2,82.9 21.8,81.5 21.8,79 21.1,78.3 R7.2
N$18  (via drill 0.6)
  Top 0.254: U1.82 46.2,66.6 46.8,67.2 46.9,67.3 48.4,67.3 49.6,66.1 52,66.1 52.9,65.2 52.9,60.8 50.4,58.3 47.7,58.3 | v25.1,47.4 26.4,47.4 28.3,45.5 37,45.5 38.6,47.1 43.4,47.1 44.4,48.1 44.4,49 45,49.6 46.6,49.6 47.7,50.7 47.7,58.3 | R1.1 15,53.6 v18.6,50 | DC21.1 45.45,60.15 46.4,59.2 47.2,59.2 47.7,58.7 47.7,58.3
  Bottom 0.254: v25.1,47.4 24.2,48.3 20.3,48.3 v18.6,50
N$19
  Top 1.016: JP7.1 JP8.1
  Bottom 0.254: 7.9,45.6 7.85,45.65 IC3.4
  Bottom 1.27: JP7.1 10.13,41.87 7.9,44.1 7.9,45.6
  pour Top (no thermals): 17.9,44.1 arc-180 17.9,40.5 10.5,40.5 arc-180 10.5,44.1
N$20  (via drill 0.6)
  Top 0.254: U1.19 32.1,79.4 33,80.3 33,86.4 v33.7,87.1
  Bottom 0.254: v33.7,87.1 32.2,89 23,89 21.9,87.9 21.9,87.1 R8.2
N$21
  Top 0.61: U2.39 46.25,4.95 X1.1
N$22
  Top 0.254: R36.1 44,50.2 44,55.6 44.4,56 R22.2 43.7,57.8 43.7,60.5 42.6,61.6 U1.75
N$23
  Top 0.254: U1.44 25.7,66.6 24.6,65.5 24.6,62.7 24.3,62.4 R5.1
N$25
  Top 0.254: U2.10 52.6,29.1 53.4,29.9 53.4,33.7 51.9,35.2 49.9,35.2 48.9,36.2 48.9,39.6 50.6,41.3 T1.3
N$26
  Top 0.254: R28.1 25.25,59.05 LED3.A
N$27
  Top 0.254: R26.2 LED4.A
N$28  (via drill 0.6)
  Top 0.254: R1.2 9.9,53.8 9.85,53.75 v9.2,53.1
  Bottom 0.254: IC3.7 9.73,52.56 v9.2,53.1
N$29
  Top 0.406: U$2.SIM_CLK 18.25,10 R11.2
N$30
  Top 0.254: U1.33 23.54,72.1 O1.2
  Bottom 0.406: C7.2 24.76,72.94 O1.2
N$31
  Top 0.254: U1.34 25.3,71.6 22.7,69 O1.1
  Bottom 0.406: C8.2 24.67,67.86 O1.1
N$32
  Top 0.254: JP3.3 10.67,69.97 12,71.3 14.3,71.3 15.1,70.5 15.1,68.9 15.7,68.3 15.7,67.7 16.1,67.3 18.9,67.3 20.9,65.3 20.9,64.4 R30.2
  Bottom 0.254: JP3.3 10.67,68.37 9,66.7 DC13.2
N$33
  Top 0.254: R28.2 27.4,62.5 28.3,61.6 U1.51
N$34
  Top 0.254: LED1.A 27.75,59.05 29,57.8 R27.1
N$35
  Bottom 0.254: R23.1 R8.1 17.4,85.8 14.6,83 14.6,82 15.16,81.44 U$1.CS
N$36
  Top 0.254: R3.2 R2.2 6.3,50.6 2.6,54.3 2.6,73.2 18.7,89.3 54.4,89.3 55.2,88.5 55.2,69.3 54.6,68.7 50.1,68.7 49.5,69.3 48.8,69.3 47.6,70.5 46,70.5 44.1,68.6 U1.86
N$37
  Top 0.152: 4.83,41.94 JP9.1
  Top 0.254: JP9.1 4.07,41.87 2.9,40.7 2.9,38.2 4,37.1 R26.1 | R2.1 4.5,42.27 4.83,41.94
  Bottom 1.27: D3.A 3.71,43.06 JP9.1
N$38
  Top 0.254: T1.1 52,45.45 R4.1
N$39
  Top 0.254: R25.2 29.1,78.9 U1.25
N$40
  Top 0.254: U1.46 26.2,65.6 25.7,65.1 25.7,62.1 23,59.4 R14.2
N$41
  Top 0.254: U1.45 26,66.1 25.1,65.2 25.1,62.4 24,61.3 R15.2
N$42
  Top 0.254: R29.2 R14.1 20.2,58.6 18.9,58.6 18.3,58 18.3,53.5 23.8,48 23.8,37.6 U2.21
N$43
  Top 0.254: R15.1 19.2,61.3 17.2,59.3 17.2,53.2 21.8,48.6 21.8,35.9 28.6,29.1 U2.22
N$44
  Top 0.254: U1.74 40.6,58.8 | 40.6,58.8 R19.2 | 40.6,58.8 R34.1
N$45
  Top 0.254: JP5.5 49.38,83.72 50,83.1 R39.2
N$47
  Top 0.254: R31.2 51.1,81.1 R20.1 50.3,79.6 49.7,79 49,79 48.4,78.4 48.4,76.2 45.8,73.6 U1.96
N$48
  Top 0.254: R27.2 30.5,59.6 31.1,60.2 U1.55
N$49
  Top 0.254: U1.22 30.6,79.1 27.8,81.9 26.69,81.9 JP4.1 22.13,84.43 R35.1
N$50
  Top 0.254: R17.2 47.4,37.6 46.25,36.45 U2.13
N$51
  Top 0.254: R17.1 45.5,39.9 LED6.A
N$52
  Top 0.254: 45.31,54.11 JP6.1 46.2,54.39 R22.1
N$53
  Top 0.254: R21.1 48.3,73.4 49.34,72.36 JP1.1
N$54
  Top 0.254: U1.94 45.6,72.6 46.6,71.6 R21.2 | R21.2 47.55,71.6 | R21.2 47.9,71.6 49.5,70 DC17.1
N$55
  Top 0.254: R30.1 23.5,65.2 25.4,67.1 U1.43
N$56
  Top 0.254: JP6.2 42.77,57.03 R19.1
N$57
  Top 0.254: R31.1 52.1,78.74 JP1.3
N$58
  Top 0.254: R32.2 34.7,55.8 31.5,55.8 30.47,54.77 JP2.2
N$60
  Top 0.254: R18.1 53.8,84.35 LED5.A
N$61
  Bottom 0.254: JP10.2 50.8,61.4 R41.1
N$62
  Top 0.254: U1.63 35.1,59.6 R32.1
N$63
  Top 0.254: JP2.1 34.7,53.5 38,56.8 R33.2
N$64  (via drill 0.6)
  Top 0.254: R35.2 18.7,82.8 v18.7,74.7
  Bottom 0.254: U$1.DOUT 17.24,75.96 17.5,75.7 17.5,75.1 17.9,74.7 v18.7,74.7
N$65
  Bottom 0.813: D11.K 27.8,44.5 L6.1 28.7,43.5 L4.1 29.5,42.7 IC1.2
N$66
  Top 0.254: U1.64 35.6,60.6 36.2,60 37.3,60 38,59.3 R33.1
N$67
  Top 0.406: U$2.SIM_DATA 20.06,11.26 20.6,11.8 R47.2
N$68
  Top 0.406: R47.1 26,11.8 28,13.8 28,16.7 28.8,17.5 U2.29
N$69  (via drill 0.6)
  Top 0.254: U1.78 44.3,64.6 45.1,63.8 45.1,62.8 44.3,62 44.3,59.3 45.2,58.4 46.6,58.4 47,58 47,51.2 v46.4,50.6 | v52,49.7 R4.2
  Bottom 0.254: v46.4,50.6 49.7,50.6 50.6,49.7 v52,49.7
N$70
  Top 0.254: D2.K 28.8,24.7 U2.26
N$71
  Top 0.254: U1.1 41.1,78.2 42.4,79.5 44.4,79.5 45.9,81 R40.2 47,80.9 R39.1
N$73
  Bottom 0.254: JP10.1 50.8,68.05 T3.1
N$74
  Bottom 0.254: R42.1 50.85,70.1 T3.2
N$75  (via drill 0.6)
  Top 0.254: U1.85 44.4,68.1 45.8,69.5 v47,69.5
  Bottom 0.254: DC14.2 47.85,64.75 49.2,66.1 R42.2 48.2,68.3 v47,69.5
N$76
  Top 0.254: R43.2 48.2,49.2 R44.2 48.3,49.4 48.3,55.8 49.8,57.3 50.8,57.3 53.6,60.1 53.6,65.5 52.3,66.8 50,66.8 48.9,67.9 46.6,67.9 45.8,67.1 U1.83
N$77
  Bottom 1.016: IC2.2 20.8,32.8 D1.K 22.4,32.2 26,28.6 26,21.6 | 24.3,19.6 L2.1 24.7,19.5 26,20.8 26,21.6 | L3.1 26,21.6
N$78
  Bottom 0.406: IC2.4 16.7,29.4 17.4,28.7 17.4,25.5 16.4,24.5 R45.2 | 15.4,24.5 R45.2 | R45.2 R46.1
N$79
  Top 0.254: U1.84 45.1,67.6 46,68.5 49.3,68.5 50.1,67.7 53.3,67.7 54.3,66.7 54.3,38.73 JP18.1
N$90
  Bottom 0.254: 10.3,45.6 10.35,45.65 IC3.1
  Bottom 1.27: D3.K 5.62,47.8 9,47.8 10.3,46.5 10.3,45.6
N$91
  Bottom 0.254: DC20.2 8.46,51.38 IC3.6
VDD  (via drill 0.6)
  Top 0.254: 36.6,76.4 41.2,76.4 42,75.6 U1.100 43.1,76.4 44.1,77.4 DC2.1 44.95,78.05 46,79.1 R40.1 47.3,79.1 R20.2 | 36.6,76.4 U1.10 36.6,78.7 37.1,79.2 37.7,79.2 38.35,79.85 DC5.1 | 36.6,76.4 28.7,76.4 28.3,76 28.3,73.1 | 28.3,73.1 U1.31 25.7,73.1 25,73.8 25,76.95 DC4.1 23.9,77.3 | 34.1,62.8 U1.61 34.1,60.5 31.65,58.05 DC1.1 | DC3.1 47.05,62.65 44.1,65.6 U1.80 42.1,65.6 41.9,65.4 41.9,63.2 41.5,62.8 34.1,62.8 | 34.1,62.8 28.7,62.8 28.3,63.2 28.3,70.6 | 28.3,70.6 28.3,73.1 | v29.4,70.6 28.3,70.6
  Bottom 0.254: v29.4,70.6 L1.2 34.15,70.6
  Bottom 0.406: L1.2 36.15,70.6 DC18.2
  Bottom 0.61: 36.1,70.55 DC18.2
(copper drawn outside any net)
  shapes: Bottom area x2

### Text on the board
tPlace: L-80
tNames: C | GND | Tx | Rx | RI | B | RST | A | GND | S | GND | IIC | +5 | SCL | SDA | F | GND | +5 | Tx | Rx | 3.3 | GND | M | D | A | E